# Altium schematic sheet SAFMR_main.SchDoc
size 594 x 420 mm; SheetNumber: 1; SheetTotal: 1
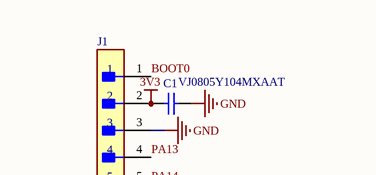
[diagram p0: SAFMR_main.SchDoc, top left]
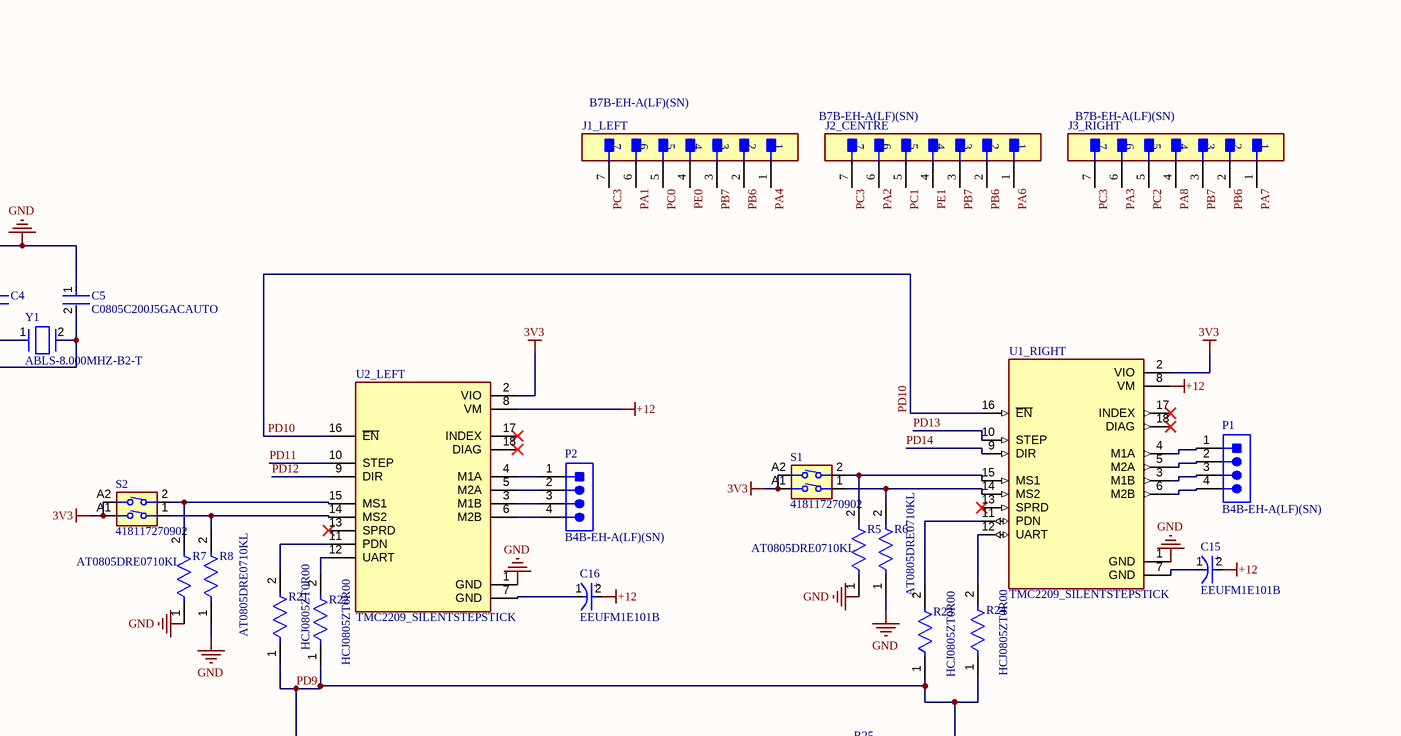
[diagram p1: SAFMR_main.SchDoc, top right]
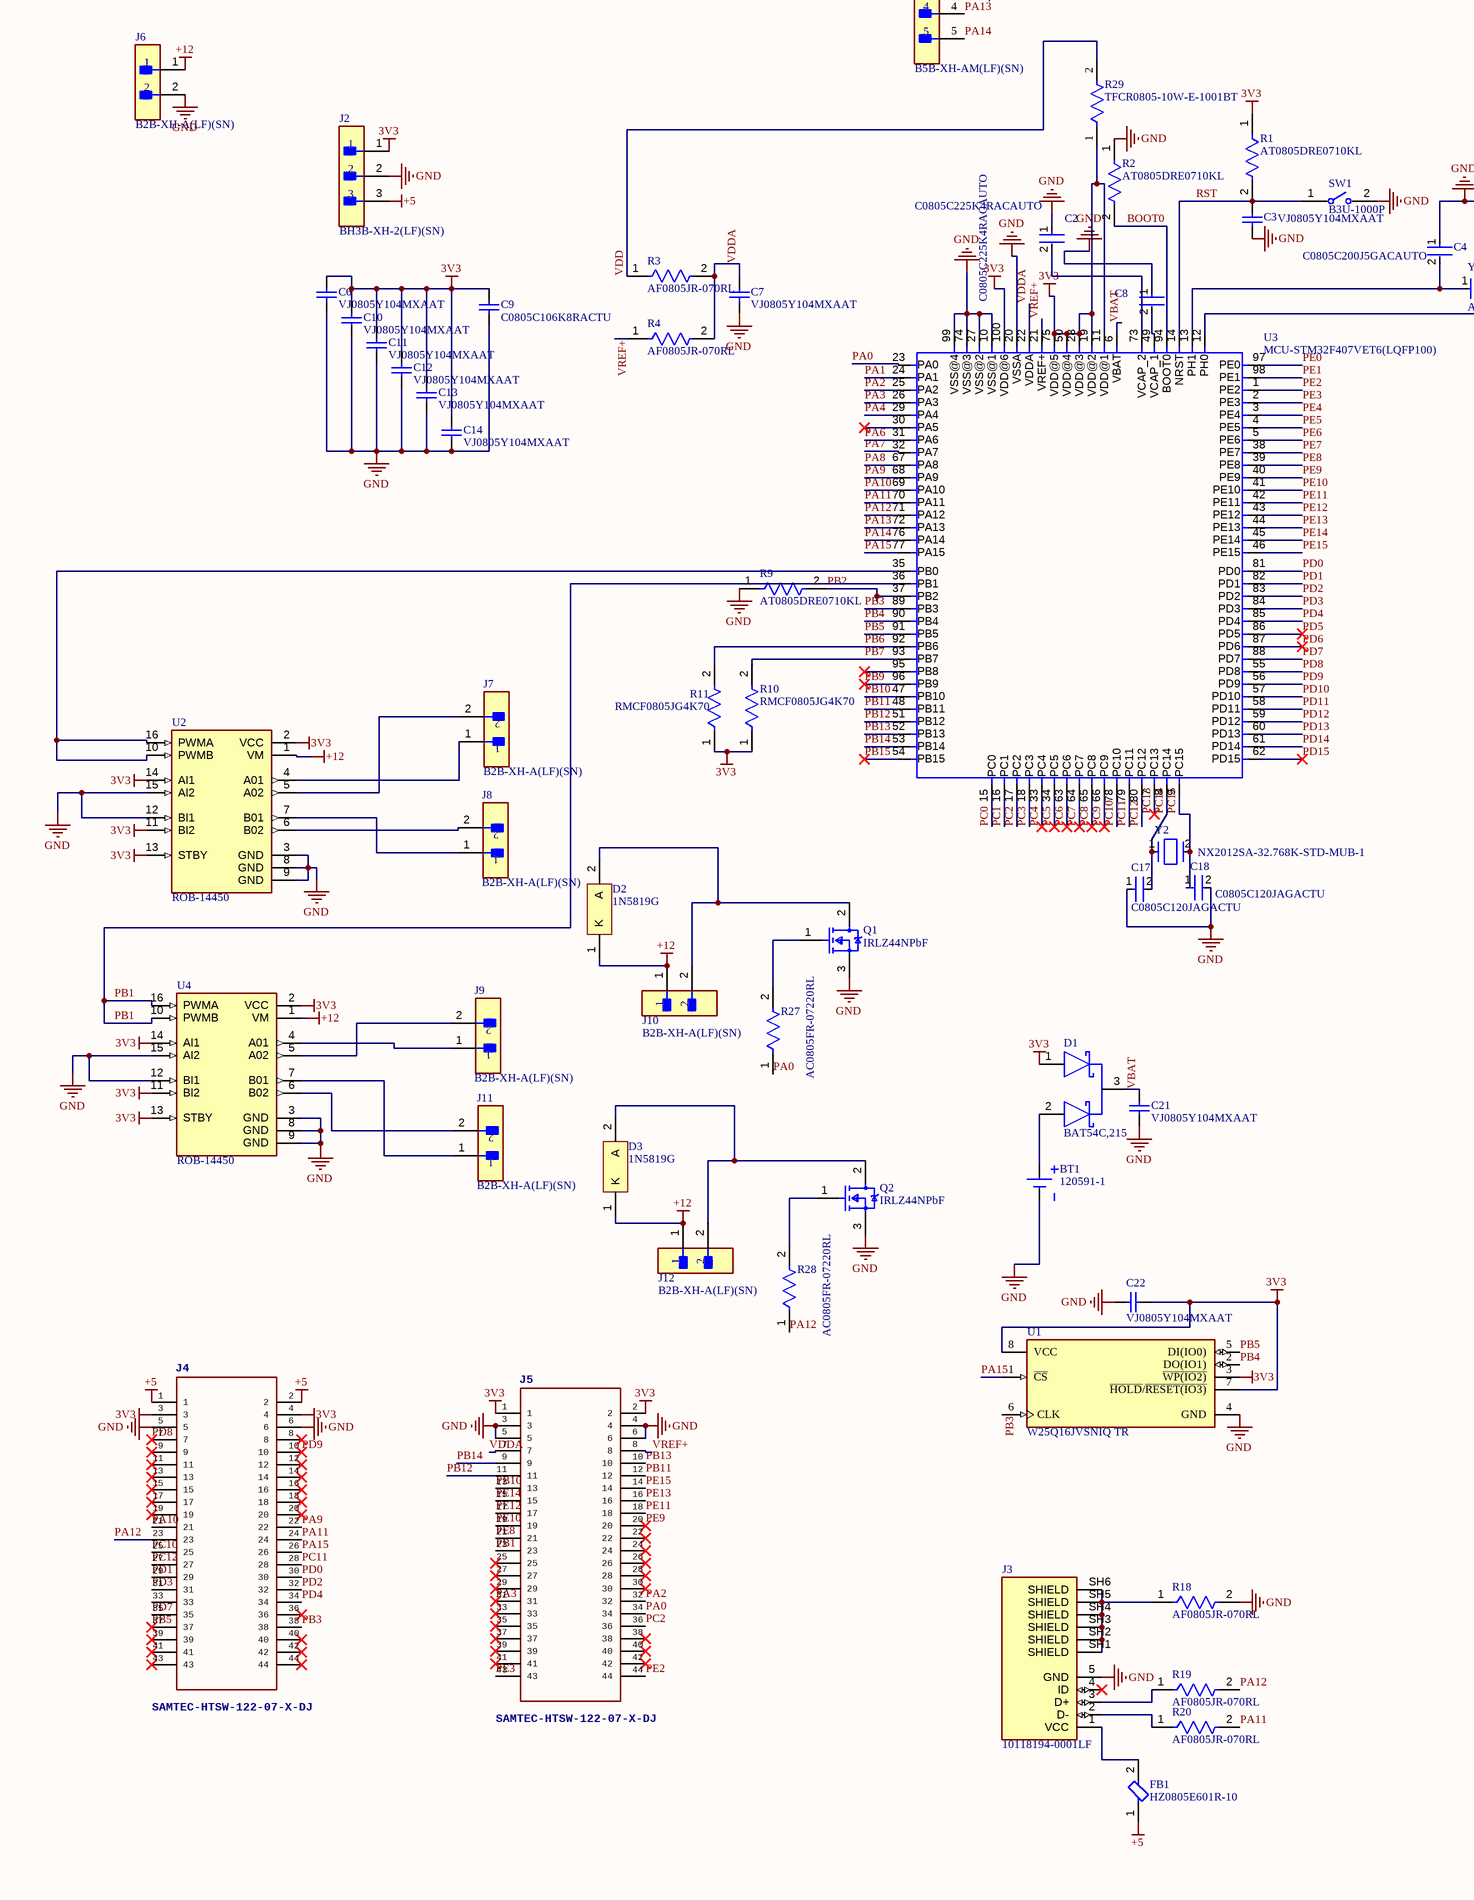
[diagram p2: SAFMR_main.SchDoc, bottom left]
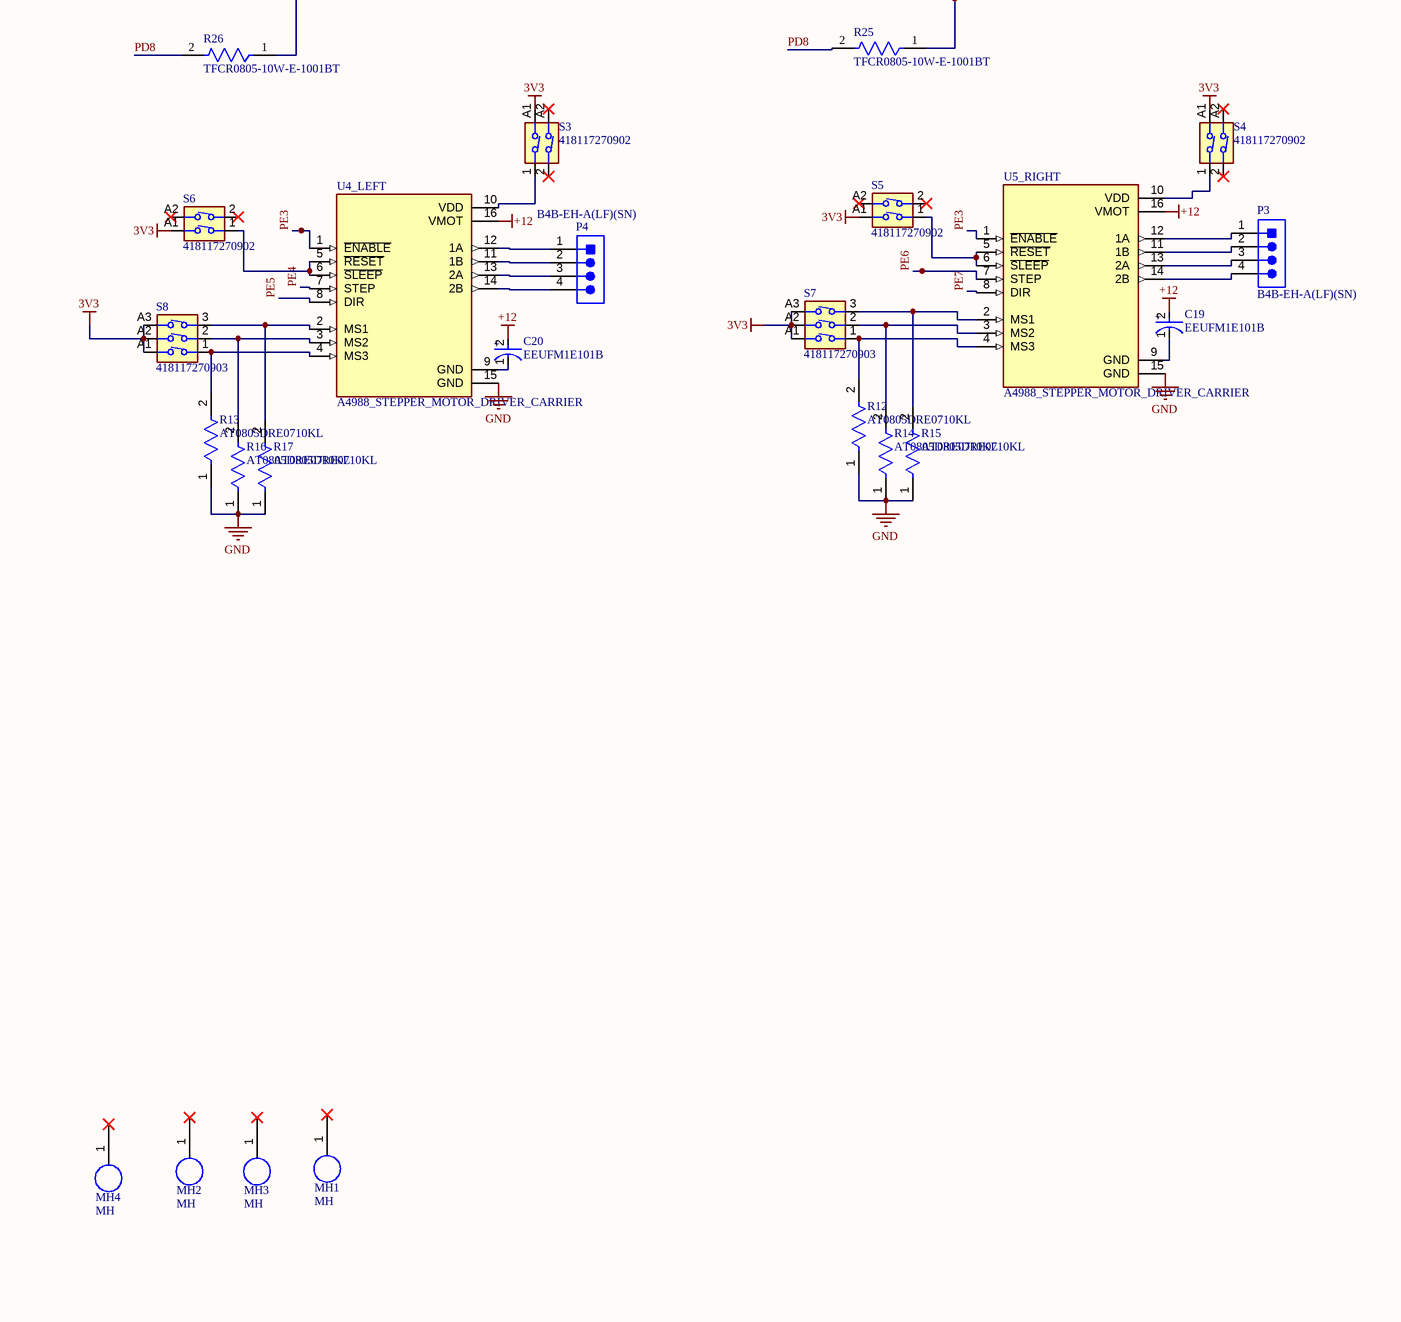
[diagram p3: SAFMR_main.SchDoc, bottom right]

## Parts
BT1  120591-1  [TECO-120591-1-2_V]
C1  VJ0805Y104MXAAT  [CAPC2013X145X48NL20T23]
C2  C0805C225K4RACAUTO  [FP-C0805C225K4RACAUTO-MFG]
C3  VJ0805Y104MXAAT  [CAPC2013X145X48NL20T23]
C4  C0805C200J5GACAUTO  [FP-C0805C-DN-MFG]
C5  C0805C200J5GACAUTO  [FP-C0805C-DN-MFG]
C6  VJ0805Y104MXAAT  [CAPC2013X145X48NL20T23]
C7  VJ0805Y104MXAAT  [CAPC2013X145X48NL20T23]
C8  C0805C225K4RACAUTO  [FP-C0805C225K4RACAUTO-MFG]
C9  C0805C106K8RACTU  [CAPC2013X145X50LL20T25]
C10  VJ0805Y104MXAAT  [CAPC2013X145X48NL20T23]
C11  VJ0805Y104MXAAT  [CAPC2013X145X48NL20T23]
C12  VJ0805Y104MXAAT  [CAPC2013X145X48NL20T23]
C13  VJ0805Y104MXAAT  [CAPC2013X145X48NL20T23]
C14  VJ0805Y104MXAAT  [CAPC2013X145X48NL20T23]
C15  EEUFM1E101B  [FP-RAD-TH-D_6_3_0_5-L_11-MFG]
C16  EEUFM1E101B  [FP-RAD-TH-D_6_3_0_5-L_11-MFG]
C17  C0805C120JAGACTU  [FP-C0805C-DN-MFG]
C18  C0805C120JAGACTU  [FP-C0805C-DN-MFG]
C19  EEUFM1E101B  [FP-RAD-TH-D_6_3_0_5-L_11-MFG]
C20  EEUFM1E101B  [FP-RAD-TH-D_6_3_0_5-L_11-MFG]
C21  VJ0805Y104MXAAT  [CAPC2013X145X48NL20T23]
C22  VJ0805Y104MXAAT  [CAPC2013X145X48NL20T23]
D1  BAT54C,215  [FP-SOT23-MFG]
D2  1N5819G  [ONSC-AXIAL_LEAD-2-59-10_P]
D3  1N5819G  [ONSC-AXIAL_LEAD-2-59-10_P]
FB1  HZ0805E601R-10  [FP-HZ0805-MFG]
J1  B5B-XH-AM(LF)(SN)  [FP-B5B-XH-AM_LF_SN-MFG]
J1_LEFT  B7B-EH-A(LF)(SN)  [FP-B7B-EH-A_LF_SN-MFG]
J2  BH3B-XH-2(LF)(SN)  [FP-BH3B-XH-2_LF_SN-MFG]
J2_CENTRE  B7B-EH-A(LF)(SN)  [FP-B7B-EH-A_LF_SN-MFG]
J3  10118194-0001LF  [AMPHENOL_10118194-0001LF]
J3_RIGHT  B7B-EH-A(LF)(SN)  [FP-B7B-EH-A_LF_SN-MFG]
J4  SAMTEC-HTSW-122-07-X-DJ  [SAMTEC-HTSW-122-07-X-D]
J5  SAMTEC-HTSW-122-07-X-DJ  [SAMTEC-HTSW-122-07-X-D]
J6  B2B-XH-A(LF)(SN)  [FP-B2B-XH-A_LF_SN-MFG]
J7  B2B-XH-A(LF)(SN)  [FP-B2B-XH-A_LF_SN-MFG]
J8  B2B-XH-A(LF)(SN)  [FP-B2B-XH-A_LF_SN-MFG]
J9  B2B-XH-A(LF)(SN)  [FP-B2B-XH-A_LF_SN-MFG]
J10  B2B-XH-A(LF)(SN)  [FP-B2B-XH-A_LF_SN-MFG]
J11  B2B-XH-A(LF)(SN)  [FP-B2B-XH-A_LF_SN-MFG]
J12  B2B-XH-A(LF)(SN)  [FP-B2B-XH-A_LF_SN-MFG]
MH1  MH  [MH]
MH2  MH  [MH]
MH3  MH  [MH]
MH4  MH  [MH]
P1  B4B-EH-A(LF)(SN)  [JST-B4B-EH-A_V]
P2  B4B-EH-A(LF)(SN)  [JST-B4B-EH-A_V]
P3  B4B-EH-A(LF)(SN)  [JST-B4B-EH-A_V]
P4  B4B-EH-A(LF)(SN)  [JST-B4B-EH-A_V]
Q1  IRLZ44NPbF  [FP-PG-TO220-3-MFG]
Q2  IRLZ44NPbF  [FP-PG-TO220-3-MFG]
R1  AT0805DRE0710KL  [FP-AT0805-MFG]
R2  AT0805DRE0710KL  [FP-AT0805-MFG]
R3  AF0805JR-070RL  [FP-AF0805-IPC_B]
R4  AF0805JR-070RL  [FP-AF0805-IPC_B]
R5  AT0805DRE0710KL  [FP-AT0805-MFG]
R6  AT0805DRE0710KL  [FP-AT0805-MFG]
R7  AT0805DRE0710KL  [FP-AT0805-MFG]
R8  AT0805DRE0710KL  [FP-AT0805-MFG]
R9  AT0805DRE0710KL  [FP-AT0805-MFG]
R10  RMCF0805JG4K70  [FP-RMCF0805-MFG]
R11  RMCF0805JG4K70  [FP-RMCF0805-MFG]
R12  AT0805DRE0710KL  [FP-AT0805-MFG]
R13  AT0805DRE0710KL  [FP-AT0805-MFG]
R14  AT0805DRE0710KL  [FP-AT0805-MFG]
R15  AT0805DRE0710KL  [FP-AT0805-MFG]
R16  AT0805DRE0710KL  [FP-AT0805-MFG]
R17  AT0805DRE0710KL  [FP-AT0805-MFG]
R18  AF0805JR-070RL  [FP-AF0805-IPC_B]
R19  AF0805JR-070RL  [FP-AF0805-IPC_B]
R20  AF0805JR-070RL  [FP-AF0805-IPC_B]
R21  HCJ0805ZT0R00  [FP-HCJ0805-MFG]
R22  HCJ0805ZT0R00  [FP-HCJ0805-MFG]
R23  HCJ0805ZT0R00  [FP-HCJ0805-MFG]
R24  HCJ0805ZT0R00  [FP-HCJ0805-MFG]
R25  TFCR0805-10W-E-1001BT  [FP-TFCR0805-IPC_A]
R26  TFCR0805-10W-E-1001BT  [FP-TFCR0805-IPC_A]
R27  AC0805FR-07220RL  [FP-AC0805-MFG]
R28  AC0805FR-07220RL  [FP-AC0805-MFG]
R29  TFCR0805-10W-E-1001BT  [FP-TFCR0805-IPC_A]
S1  418117270902  [418117270902]
S2  418117270902  [418117270902]
S3  418117270902  [418117270902]
S4  418117270902  [418117270902]
S5  418117270902  [418117270902]
S6  418117270902  [418117270902]
S7  418117270903  [418117270903]
S8  418117270903  [418117270903]
SW1  B3U-1000P  [FP-B3U-1000P-MFG]
U1  W25Q16JVSNIQ TR  [FP-W25Q16JVSNIQ_TR-IPC_A]
U1_RIGHT  TMC2209_SILENTSTEPSTICK  [MODULE_TMC2209_SILENTSTEPSTICK]
U2  ROB-14450  [MODULE_ROB-14450]
U2_LEFT  TMC2209_SILENTSTEPSTICK  [MODULE_TMC2209_SILENTSTEPSTICK]
U3  MCU-STM32F407VET6(LQFP100)  [LQFP100-0.5-13.8X13.8MM]
U4  ROB-14450  [MODULE_ROB-14450]
U4_LEFT  A4988_STEPPER_MOTOR_DRIVER_CARRIER  [MODULE_A4988_STEPPER_MOTOR_DRIVER_CARRIER]
U5_RIGHT  A4988_STEPPER_MOTOR_DRIVER_CARRIER  [MODULE_A4988_STEPPER_MOTOR_DRIVER_CARRIER]
Y1  ABLS-8.000MHZ-B2-T  [FP-ABLS-MFG]
Y2  NX2012SA-32.768K-STD-MUB-1  [FP-NX2012SA-MFG]

## Nets
3V3: C1.2 C6.2 C9.2 C10.2 C11.2 C12.2 C13.2 C14.2 C22.1 D1.1(1_ANODE) J1.2 J2.1 J4.3 J4.4 J5.1 J5.2 R1.1 R10.1 R11.1 R29.1 S1.A1 S1.A2 S2.A1 S2.A2 S3.A1 S4.A1 S5.A1 S6.A1 S7.A1 S7.A2 S7.A3 S8.A1 S8.A2 S8.A3 U1.3(~{WP(IO2)}) U1.7(~{HOLD}/~{RESET(IO3)}) U1.8(VCC) U1_RIGHT.2(VIO) U2.2(VCC) U2.11(BI2) U2.13(STBY) U2.14(AI1) U2_LEFT.2(VIO) U3.11(VDD@1) U3.19(VDD@2) U3.28(VDD@3) U3.50(VDD@4) U3.75(VDD@5) U3.100(VDD@6) U4.2(VCC) U4.11(BI2) U4.13(STBY) U4.14(AI1)
+5: FB1.1 J2.3 J4.1 J4.2
+12: C15.2(A) C16.2(A) C19.2(A) C20.2(A) D2.1(K) D3.1(K) J6.1 J10.1 J12.1 U1_RIGHT.8(VM) U2.1(VM) U2_LEFT.8(VM) U4.1(VM) U4_LEFT.16(VMOT) U5_RIGHT.16(VMOT)
GND: BT1.2(-) C1.1 C2.1 C3.1 C4.1 C5.1 C6.1 C7.1 C8.1 C9.1 C10.1 C11.1 C12.1 C13.1 C14.1 C17.1 C18.2 C21.1 C22.2 J1.3 J2.2 J3.5(GND) J4.5 J4.6 J5.3 J5.4 J5.5 J5.6 J6.2 Q1.3(S) Q2.3(S) R2.1 R5.1 R6.1 R7.1 R8.1 R9.1 R12.1 R13.1 R14.1 R15.1 R16.1 R17.1 R18.2 SW1.2 U1.4(GND) U1_RIGHT.1(GND) U2.3(GND) U2.8(GND) U2.9(GND) U2.12(BI1) U2.15(AI2) U2_LEFT.1(GND) U3.10(VSS@1) U3.20(VSSA) U3.27(VSS@2) U3.74(VSS@3) U3.99(VSS@4) U4.3(GND) U4.8(GND) U4.9(GND) U4.12(BI1) U4.15(AI2) U4_LEFT.15(GND) U5_RIGHT.15(GND)
BOOT0: J1.1 R2.2 U3.94(BOOT0)
PA0: J5.34 R27.1 U3.23(PA0)
PA1: J1_LEFT.6 U3.24(PA1)
PA2: J2_CENTRE.6 J5.32 U3.25(PA2)
PA3: J3_RIGHT.6 J5.31 U3.26(PA3)
PA4: J1_LEFT.1 U3.29(PA4)
PA6: J2_CENTRE.1 U3.31(PA6)
PA7: J3_RIGHT.1 U3.32(PA7)
PA8: J3_RIGHT.4 U3.67(PA8)
PA9: J4.22 U3.68(PA9)
PA10: J4.21 U3.69(PA10)
PA11: J4.24 R20.2 U3.70(PA11)
PA12: J4.23 R19.2 R28.1 U3.71(PA12)
PA13: J1.4 U3.72(PA13)
PA14: J1.5 U3.76(PA14)
PA15: J4.26 U1.1(~{CS}) U3.77(PA15)
PB1: J5.23 U3.36(PB1) U4.10(PWMB) U4.16(PWMA)
PB2: R9.2 U3.37(PB2)
PB3: J4.38 U1.6(CLK) U3.89(PB3)
PB4: U1.2(DO(IO1)) U3.90(PB4)
PB5: J4.37 U1.5(DI(IO0)) U3.91(PB5)
PB6: J1_LEFT.2 J2_CENTRE.2 J3_RIGHT.2 R11.2 U3.92(PB6)
PB7: J1_LEFT.3 J2_CENTRE.3 J3_RIGHT.3 R10.2 U3.93(PB7)
PB9: U3.96(PB9)
PB10: J5.13 U3.47(PB10)
PB11: J5.12 U3.48(PB11)
PB12: J5.11 U3.51(PB12)
PB13: J5.10 U3.52(PB13)
PB14: J5.9 U3.53(PB14)
PB15: U3.54(PB15)
PC0: J1_LEFT.5 U3.15(PC0)
PC1: J2_CENTRE.5 U3.16(PC1)
PC2: J3_RIGHT.5 J5.36 U3.17(PC2)
PC3: J1_LEFT.7 J2_CENTRE.7 J3_RIGHT.7 U3.18(PC3)
PC4: U3.33(PC4)
PC5: U3.34(PC5)
PC6: U3.63(PC6)
PC7: U3.64(PC7)
PC8: U3.65(PC8)
PC9: U3.66(PC9)
PC10: J4.25 U3.78(PC10)
PC11: J4.28 U3.79(PC11)
PC12: J4.27 U3.80(PC12)
PC13: U3.7(PC13)
PC14: C17.2 U3.8(PC14) Y2.1
PC15: C18.1 U3.9(PC15) Y2.2
PD0: J4.30 U3.81(PD0)
PD1: J4.29 U3.82(PD1)
PD2: J4.32 U3.83(PD2)
PD3: J4.31 U3.84(PD3)
PD4: J4.34 U3.85(PD4)
PD5: U3.86(PD5)
PD6: U3.87(PD6)
PD7: J4.35 U3.88(PD7)
PD8: J4.7 R25.2 R26.2 U3.55(PD8)
PD9: J4.10 R21.1 R22.1 R23.1 R24.1 R25.1 R26.1 U3.56(PD9)
PD10: U1_RIGHT.16(~{EN}) U2_LEFT.16(~{EN}) U3.57(PD10)
PD11: U2_LEFT.10(STEP) U3.58(PD11)
PD12: U2_LEFT.9(DIR) U3.59(PD12)
PD13: U1_RIGHT.10(STEP) U3.60(PD13)
PD14: U1_RIGHT.9(DIR) U3.61(PD14)
PD15: U3.62(PD15)
PE0: J1_LEFT.4 U3.97(PE0)
PE1: J2_CENTRE.4 U3.98(PE1)
PE2: J5.44 U3.1(PE2)
PE3: J5.43 U3.2(PE3) U4_LEFT.1(~{ENABLE}) U5_RIGHT.1(~{ENABLE})
PE4: U3.3(PE4) U4_LEFT.7(STEP)
PE5: U3.4(PE5) U4_LEFT.8(DIR)
PE6: U3.5(PE6) U5_RIGHT.7(STEP)
PE7: U3.38(PE7) U5_RIGHT.8(DIR)
PE8: J5.21 U3.39(PE8)
PE9: J5.20 U3.40(PE9)
PE10: J5.19 U3.41(PE10)
PE11: J5.18 U3.42(PE11)
PE12: J5.17 U3.43(PE12)
PE13: J5.16 U3.44(PE13)
PE14: J5.15 U3.45(PE14)
PE15: J5.14 U3.46(PE15)
RST: C3.2 R1.2 SW1.1 U3.14(NRST)
VBAT: C21.2 D1.3(COMMON_CATHODE) U3.6(VBAT)
VDD: R3.1 R29.2
VDDA: C7.2 J5.7 R3.2 R4.2 U3.22(VDDA)
VREF+: J5.8 R4.1 U3.21(VREF+)
NetBT1_1: BT1.1(+) D1.2(2_ANODE)
NetC2_2: C2.2 U3.73(VCAP_2)
NetC4_2: C4.2 U3.13(PH1) Y1.1
NetC5_2: C5.2 U3.12(PH0) Y1.2
NetC8_2: C8.2 U3.49(VCAP_1)
NetC15_1: C15.1(C) U1_RIGHT.7(GND)
NetC16_1: C16.1(C) U2_LEFT.7(GND)
NetC19_1: C19.1(C) U5_RIGHT.9(GND)
NetC20_1: C20.1(C) U4_LEFT.9(GND)
NetD2_2: D2.2(A) J10.2 Q1.2(D)
NetD3_2: D3.2(A) J12.2 Q2.2(D)
NetFB1_2: FB1.2 J3.1(VCC)
NetJ3_2: J3.2(D-) R20.1
NetJ3_3: J3.3(D+) R19.1
NetJ3_SH1: J3.SH1(SHIELD) J3.SH2(SHIELD) J3.SH3(SHIELD) J3.SH4(SHIELD) J3.SH5(SHIELD) J3.SH6(SHIELD) R18.1
NetJ7_1: J7.1 U2.4(A01)
NetJ7_2: J7.2 U2.5(A02)
NetJ8_1: J8.1 U2.7(B01)
NetJ8_2: J8.2 U2.6(B02)
NetJ9_1: J9.1 U4.4(A01)
NetJ9_2: J9.2 U4.5(A02)
NetJ11_1: J11.1 U4.7(B01)
NetJ11_2: J11.2 U4.6(B02)
NetP1_1: P1.1 U1_RIGHT.4(M1A)
NetP1_2: P1.2 U1_RIGHT.5(M2A)
NetP1_3: P1.3 U1_RIGHT.3(M1B)
NetP1_4: P1.4 U1_RIGHT.6(M2B)
NetP2_1: P2.1 U2_LEFT.4(M1A)
NetP2_2: P2.2 U2_LEFT.5(M2A)
NetP2_3: P2.3 U2_LEFT.3(M1B)
NetP2_4: P2.4 U2_LEFT.6(M2B)
NetP3_1: P3.1 U5_RIGHT.12(1A)
NetP3_2: P3.2 U5_RIGHT.11(1B)
NetP3_3: P3.3 U5_RIGHT.13(2A)
NetP3_4: P3.4 U5_RIGHT.14(2B)
NetP4_1: P4.1 U4_LEFT.12(1A)
NetP4_2: P4.2 U4_LEFT.11(1B)
NetP4_3: P4.3 U4_LEFT.13(2A)
NetP4_4: P4.4 U4_LEFT.14(2B)
NetQ1_1: Q1.1(G) R27.2
NetQ2_1: Q2.1(G) R28.2
NetR5_2: R5.2 S1.2 U1_RIGHT.15(MS1)
NetR6_2: R6.2 S1.1 U1_RIGHT.14(MS2)
NetR7_2: R7.2 S2.2 U2_LEFT.15(MS1)
NetR8_2: R8.2 S2.1 U2_LEFT.14(MS2)
NetR12_2: R12.2 S7.1 U5_RIGHT.4(MS3)
NetR13_2: R13.2 S8.1 U4_LEFT.4(MS3)
NetR14_2: R14.2 S7.2 U5_RIGHT.3(MS2)
NetR15_2: R15.2 S7.3 U5_RIGHT.2(MS1)
NetR16_2: R16.2 S8.2 U4_LEFT.3(MS2)
NetR17_2: R17.2 S8.3 U4_LEFT.2(MS1)
NetR21_2: R21.2 U2_LEFT.11(PDN)
NetR22_2: R22.2 U2_LEFT.12(UART)
NetR23_2: R23.2 U1_RIGHT.11(PDN)
NetR24_2: R24.2 U1_RIGHT.12(UART)
NetS3_1: S3.1 U4_LEFT.10(VDD)
NetS4_1: S4.1 U5_RIGHT.10(VDD)
NetS5_1: S5.1 U5_RIGHT.5(~{RESET}) U5_RIGHT.6(~{SLEEP})
NetS6_1: S6.1 U4_LEFT.5(~{RESET}) U4_LEFT.6(~{SLEEP})
NetU2_10: U2.10(PWMB) U2.16(PWMA) U3.35(PB0)

Not connected (* = marked no-connect by the designer): J3 4(ID)*; J4 8* 9* 11* 12* 13* 14* 15* 16* 17* 18* 19* 20* 33 36* 39* 40* 41* 42* 43* 44*; J5 22* 24* 25* 26* 27* 28* 29* 30* 33* 35* 37* 38* 39* 40* 41* 42*; MH1 1*; MH2 1*; MH3 1*; MH4 1*; S3 2* A2*; S4 2* A2*; S5 2* A2*; S6 2* A2*; U1_RIGHT 13(SPRD)* 17(INDEX)* 18(DIAG)*; U2_LEFT 13(SPRD)* 17(INDEX)* 18(DIAG)*; U3 30(PA5)* 95(PB8)*

## Notes on the sheet
- DWG NO:
- REV:
- THIS DOCUMENT AND THE DATA DISCLOSED HEREIN OR
- HEREWITH IS THE PROPERTY OF ALTIUM LIMITED AND MAY
- BE FREELY DISTRIBUTED IN WHOLE. NO RIGHTS ARE
- RESERVED OR EXPRESS OR IMPLIED WARANTEE GIVEN.
- REVISION
- DESCRIPTION
- DATE
- APPROVED
- ENG:
- APPROVALS
- PROJECT
- DSN:
- CHK:
- REFERENCE DOCUMENTS
- PROJECT REVISION:
- TITLE
- DOCUMENT REVISION:
- DESIGN ITEM:
- BOM:
- FAB DWG:
- PCB DWG:
- ASSY DWG:
- SCALE:
- A2
- SIZE
- CAGE CODE
- FILE NAME
- DWG NO.
- SHEET
- OF
- REV
- (in symbol CMP-05427-000856-1) +

## Library data of the parts
BT1 = CMP-0438-00001-2: Lithium Battery Holder for CR2032 3V Cell; Manufacturer: TE Connectivity; Packing Type: Tray; Body Shape: Horizontal Cylindrical; AccessRights: 2147483647; RevisionId: 1; Folder: Unified Components\Components\TE Connectivity\Connectors & Connector Components\Power Products\Battery Interconnection Products\; ContentType: Unified Component; ContentTypeGUID: CB3C11C4-E317-11DF-B822-12313F0024A2; ComponentLink1Description: Manufacturer URL; LifeCycleStateGUID: 61E382EE-6656-4F12-9E24-BE9327104A25; FolderGUID: A6761B51-D489-48A3-9180-F4808F45AB79; PartNumber: 120591-1; LifeCycle: Released; ReleaseDate: 20/08/2013 02:50:22 AM; PackageReference: 120591-1; ComponentLink2URL: http://www.te.com/commerce/DocumentDelivery/DDEController?Action=showdoc&DocId=Customer+Drawing%7F120591%7FH%7Fpdf%7FEnglish%7FENG_CD_120591_H.pdf%7F120591-1; DatasheetVersion: Rev. H, 01/2013; PackageDescription: Lithium Battery Holder; ItemGUID: B2C50140-681E-4F62-8DBB-9728605318CE; ItemHRID: CMP-0438-00001; Mounting Technology: Through Hole; ComponentLink1URL: http://www.te.com/; ComponentLink2Description: Datasheet
C1 C3 C6 C7 C10-C14 C21 C22 = CMP-2007-01733-1: Manufacturer: Vitramon; Part Number: VJ0805Y104MXAAT
C2 C8 = CMP-2007-03267-2: CAP CER 2.2UF 16V X7R 0805; Tolerance: 10%; Dielectric Material: Ceramic; Packaging: Cut Tape; Depth: 1.25mm; Package Quantity: 1; Case Code (Imperial): 0805; Contact Plating: Tin; REACH SVHC: No SVHC; Case/Package: 0805; Max Operating Temperature: 125°C; Thickness: 0.055inch; Height: 1.25mm; Mount: Surface Mount; Min Operating Temperature: -55°C; Construction: Flat; Series: C; Radiation Hardening: No; Capacitance: 2.2uF; Dielectric: X7R; Case Code (Metric): 2012; Length: 0.079inch; RoHS Compliant: Yes; Width: 0.049inch; Voltage Rating: 16V; Voltage Rating (DC): 16V; Ratings: AEC-Q200
C4 C5 = CMP-03020-000773-1: C0805 20 pF C0G 30ppm/°C 5.00% 50 V; Manufacturer: KEMET; Value: 20 pF; Tolerance: 0.05; Material: Ceramic; Voltage Rating: 50 V; Temperature Characteristic: C0G; Manufacturer Part Number: C0805C200J5GACAUTO; Lead Free: Yes; RoHS: TRUE; Ipc Land Pattern Name: CAPC200125X78; Package: C0805C-DN; Height: 0.88mm; Device Class L2: Capacitors; Temperature Coefficient: 30ppm/°C; ComponentLink2Description: Datasheet; Temperature Range Low: -55°C; Device Class L1: Passive Components; Device Class L3: Ceramic Capacitors; Temperature: -55°C to +125°C; Category: Cap; Capacitance: 20 pF; Octopart: https://octopart.com/c0805c200j5gacauto-kemet-88373638; ComponentLink2URL: https://content.kemet.com/datasheets/KEM_C1003_C0G_SMD.pdf; Automotive: No; Temperature Range High: +125°C
C9 = CMP-2007-01044-1: Manufacturer: Kemet; Part Number: C0805C106K8RACTU
C15 C16 C19 C20 = CMP-05427-000856-1: Aluminum Electrolytic Capacitors (Radial Lead Type) 100uF ±20% 25V; Lead Diameter: 0.5mm; Polarity: Polar; Ripple Current: 455mA; Impedance: 130mR; Life (Hours): 2000Hour; Length: 11mm; Min Operating Temperature: -40°C; Termination: Radial; Diameter: 6mm; Lead Pitch: 5mm; Tolerance: 20%; Capacitance: 100uF; Case/Package: Radial; Voltage Rating (DC): 25V; Height - Seated (Max): 0.5inch; RoHS Compliant: Yes; Series: FM; Package Quantity: 2000; Voltage Rating: 25V; Max Operating Temperature: 105°C; Mount: Through Hole; ESR (Equivalent Series Resistance): 130mR; Packaging: Tape and Reel
C17 C18 = CMP-03020-011084-1: C0805 12 pF C0G 30ppm/°C 5.00% 250 V; Manufacturer: KEMET; Material: Ceramic; Voltage Rating: 250 V; Value: 12 pF; Tolerance: 0.05; Category: Cap; Ipc Land Pattern Name: CAPC200125X78; Height: 0.88mm; Device Class L3: Ceramic Capacitors; Temperature: -55°C to +125°C; ComponentLink2Description: Datasheet; Temperature Characteristic: C0G; Manufacturer Part Number: C0805C120JAGACTU; Octopart: https://octopart.com/c0805c120jagactu-kemet-88373179; ComponentLink2URL: https://content.kemet.com/datasheets/KEM_C1003_C0G_SMD.pdf; Lead Free: Yes; Capacitance: 12 pF; Automotive: No; Device Class L1: Passive Components; Device Class L2: Capacitors; Temperature Range Low: -55°C; RoHS: TRUE; Temperature Coefficient: 30ppm/°C; Package: C0805C-DN; Temperature Range High: +125°C
D1 = CMP-14398-000007-1: DIODE ARRAY SCHOTTKY 30V SOT23; Manufacturer: Nexperia; Automotive Grade: Grade 0; Peak Reverse Current: 2uA; Forward Current: 200mA; Max Surge Forward Current: 600mA; Value: 10pF; Max Junction Temp: +150°C; Lead Free: Yes; Automotive: Yes; Device Class L1: Discrete Semiconductors; Digikey Description: DIODE ARRAY SCHOTTKY 30V SOT23; Reverse Voltage: 30V; ComponentLink2URL: https://assets.nexperia.com/documents/data-sheet/BAT54_SER.pdf; Device Class L2: Diodes; Category: Diode; Octopart: https://octopart.com/bat54c%2C215-nexperia-78738945; Package: SOT23; Mouser Description: Schottky Diodes, Rectifiers - Arrays SOT-23 (TO-236AB) 30V 200mA (DC) Surface Mount; RoHS: TRUE; Manufacturer Part Number: BAT54C,215; Temperature: to +150°C; Ambient Temperature Range Low: -55°C; Height: 1.1mm; Device Class L3: Schottky Diodes; Temperature Range High: +150°C; Footprint Url: https://assets.nexperia.com/documents/outline-drawing/SOT23.pdf; Capacitance: 10pF; Ambient Temperature Range High: +150°C; Ipc Land Pattern Name: SOT95P230X100-3; ComponentLink2Description: Datasheet
D2 D3 = CMP-1055-00041-1: Rectifier, 2-Pin Axial_Lead, Pb-Free, Bulk Bag; Manufacturer: On Semiconductor; IFSM Max (A): 25; Configuration: Single; PackageDescription: 2-Pin, Axial Lead, Diameter 2.35 mm; ComponentLink2URL: http://www.onsemi.cn/pub_link/Collateral/1N5817-D.PDF; ComponentLink1Description: Manufacturer URL; Mounting Technology: Through Hole; RoHS: TRUE; ComponentLink2Description: Datasheet; ComponentLink1URL: http://www.onsemi.com/; PartNumber: 1N5819G; DatasheetVersion: Rev. 10; Packing: Bulk Bag; PackageVersion: Rev. U, 02/2005; PackageReference: AXIAL_LEAD-2-59-10; ComponentLink3URL: http://www.onsemi.cn/pub_link/Collateral/59-10.PDF; ComponentLink3Description: Package Specification
FB1 = CMP-2000-05194-2: FERRITE BEAD 600 OHM 0805 1LN; Current Rating: 500mA; Frequency: 100MHz; DC Resistance (DCR): 300mR; Number of Lines: 1; Impedance: 600R; Packaging: Tape and Reel; Mount: Surface Mount; Package Quantity: 1; Material: Ferrite; Width: 0.049inch; Min Operating Temperature: -40°C; Core Material: Ferrite; Max Current Rating: 500mA; Case Code (Metric): 2012; Depth: 1.45mm; Case Code (Imperial): 0805; Termination: SMD/SMT; Contact Plating: Tin; Lead Free: Lead Free; Weight: 0.00392oz; Case/Package: 0805; Test Frequency: 100MHz; Length: 2mm; Height: 1.25mm; Max Operating Temperature: 125°C; Max DC Current: 500mA
J1 = CMP-17439-000304-1: CONN HEADER VERT 5POS 2.5MM; Mated Stacking Heights: 9.8mm; Voltage Rating: 250V; Max Current Rating: 3A; Number of Positions: 5; Contact Resistance: 20mR; Depth: 5.75mm; Connector Type: Header; Color: Green; Insulation Material: Nylon; Contact Plating: Copper; Length: 14.9mm; Fastening Type: Detent; Contact Material: Brass; Number of Rows: 1; Contact Type: Male Pin; Housing Material: Polyamide; Housing Color: White; Lead Free: Lead Free; Max Voltage Rating (AC): 250V; Mount: Through Hole; Contact Shape: Square; Min Operating Temperature: -25°C; Packaging: Bulk; Orientation: Straight; Insulation Color: Natural; Series: XH; Flammability Rating: UL94 V-0; Contact Finish - Mating: TIN; Max Operating Temperature: 85°C; Termination: Solder; Pitch: 2.5mm
J1_LEFT J2_CENTRE J3_RIGHT = CMP-17439-000532-1: CONN HEADER VERT 7POS 2.5MM; Number of Contacts: 7; Mated Stacking Heights: 8.1mm; Gender: Male; Current Rating: 3A; Voltage Rating: 250V; Termination: Solder; Contact Material: Brass; Connector Type: Header; Flammability Rating: UL94 V-0; Housing Material: Nylon; Series: EH; Fastening Type: Friction; Lead Free: Lead Free; Insulation Color: Natural; Contact Type: Male Pin; Number of Rows: 1; Packaging: Bulk; Color: Natural; Contact Finish - Mating: TIN; Orientation: Straight; Contact Shape: Square; Contact Plating: Tin; Insulation Material: Nylon; Housing Color: White; Mount: Through Hole; Contact Mating Length: 0.13inch; Pitch: 2.5mm; Number of Positions: 7
J2 = CMP-17439-000649-1: CONN HEADER VERT 3POS 2.5MM; Voltage Rating: 250V; Number of Positions: 3; Mated Stacking Heights: 9.8mm; Pitch: 2.5mm; Contact Finish - Mating: TIN; Series: XH; Width: 5.75mm; Insulation Material: Nylon; Packaging: Bulk; Min Operating Temperature: -25°C; Connector Type: Header; Insulation Color: Natural; Height: 14.2mm; Contact Material: Brass; Length: 9.9mm; Termination: Press-Fit; Fastening Type: Detent; Number of Poles: 3; Flammability Rating: UL94 V-0; Contact Type: Male Pin; Lead Free: Lead Free; Mount: Through Hole; Number of Rows: 1; Max Operating Temperature: 85°C; Contact Shape: Square
J3 = 10118194-0001LF: Micro USB, Input Output Connectors, B TYPE RECEPTACLE with flange; MF: Amphenol ICC; SnapEDA_Link: https://www.snapeda.com/parts/10118194-0001LF/Amphenol+FCI/view-part/?ref=snap; Package: None; Value: *; MP: 10118194-0001LF; Check_prices: https://www.snapeda.com/parts/10118194-0001LF/Amphenol+FCI/view-part/?ref=eda
J6-J12 = CMP-2000-05888-3: CONN HEADER VERT 2POS 2.5MM; Current Rating: 3A; Voltage Rating: 250V; Number of Contacts: 2; Contact Resistance: 20mR; Wire/Cable Gauge: 22AWG; Insulation Resistance: 1GR; Connector Type: Male Pin; Packaging: Bulk; Contact Material: Brass; Lead Free: Lead Free; Orientation: Straight; Contact Plating: Tin; Max Current Rating: 3A; Termination: Solder; Fastening Type: Detent; Depth: 5.75mm; Housing Material: Polyamide; REACH SVHC: No SVHC; Series: XH; Voltage Rating (AC): 250V; Number of Positions: 2; Color: Natural; Contact Type: Male Pin; Max Voltage Rating (DC): 250V; Pitch: 2.5mm; Lead Pitch: 2.5mm; Mount: Through Hole; Max Operating Temperature: 85°C; Length: 7.4mm; Max Voltage Rating (AC): 250V; Min Operating Temperature: -25°C; Number of Rows: 1; Housing Color: White
P1-P4 = CMP-2000-05904-1: Male Header, Pitch 2.5 mm, 1 x 4 Position, Height 6 mm, Tail Length 3.2 mm, -25 to 85 degC, RoHS, Bulk; Manufacturer: JST; Style/Orientation: StraightHeader/Plug; Pitch: 2.5mm; No of Positions: 4; Mounting Technology: SurfaceMount; Package Description: Male Header, Pitch 2.5 mm, 1 x 4 Position, Height 6 mm, Tail Length 3.2 mm; Datasheet Version: 12/2012; Type: ShroudedHeader; Package Reference: B4B-EH-A; Manufacturer URL: http://www.jst.com/home2.html; Termination: Crimp; Datasheet URL: http://www.jst-mfg.com/product/pdf/eng/eEH.pdf
Q1 Q2 = CMP-32901-000488-1: MOSFET N-CH 55V 47A TO220AB; Turn-On Delay Time: 11ns; Gate to Source Voltage (Vgs): 16V; Element Configuration: Single; Rds On Max: 22mR; Turn-Off Delay Time: 26ns; Max Power Dissipation: 110W; Threshold Voltage: 2V; Drain to Source Resistance: 35mR; Input Capacitance: 1.7nF; Continuous Drain Current (ID): 47A; Case/Package: TO-220; Lead Free: Lead Free; Halogen Free: Halogen Free; Packaging: Rail/Tube; Length: 0.414inch; Min Operating Temperature: -55°C; REACH SVHC: No SVHC; Number of Pins: 3; Width: 0.185inch; Drain to Source Voltage (Vdss): 55V; Power Dissipation: 110W; RoHS Compliant: Yes; Max Operating Temperature: 175°C; Height: 0.6inch; Max Dual Supply Voltage: 55V; Drain to Source Breakdown Voltage: 55V; Mount: Through Hole
R1 R2 R5-R9 R12-R17 = CMP-03412-049031-1: Thin Film Chip Resistors Automotive Grade 10kΩ 0.5% 50ppm/°C 0805; Max Power Dissipation: 125mW; Resistance: 10kR; Ratings: AEC-Q200; Length: 0.079inch; Temperature Coefficient: 50ppm/°C; Height: 0.024inch; Min Operating Temperature: -55°C; Case/Package: 0805; Tolerance: 0.5%; RoHS Compliant: Yes; Features: Moisture Resistant; Number of Terminations: 2; Max Operating Temperature: 155°C; Series: AT; Packaging: Tape and Reel; Width: 0.049inch; Resistor Type: Thin Film
R3 R4 R18-R20 = CMP-03412-047152-1: Anti-Sulfurated Chip Resistor Automotive Grade 0Ω Jumper 0.125W 0805; Max Power Dissipation: 125mW; Resistance: 0R; Length: 0.079inch; Package Quantity: 5000; Packaging: Tape and Reel; Height: 0.024inch; Series: AF; Number of Terminations: 2; Weight: 0.000194oz; Width: 1.25mm; Max Operating Temperature: 155°C; Case Code (Metric): 2012; Resistor Type: Thick Film; RoHS Compliant: Yes; Case Code (Imperial): 0805; Min Operating Temperature: -55°C; Case/Package: 0805; Termination: SMD/SMT; Features: Moisture Resistant
R10 R11 = CMP-26527-004085-1: 4.7kΩ ±5% 0.125W 0805 Thick Film Chip Resistor AEC-Q200 compliant; Temperature Coefficient: 200ppm/°C; Max Power Dissipation: 125mW; Resistance: 4.7kR; RoHS Compliant: Yes; Package Quantity: 10000; Packaging: Tape and Reel; Contact Plating: Tin; Radiation Hardening: No; Mount: Surface Mount; Height: 0.026inch; Case Code (Metric): 2012; Tolerance: 5%; Case/Package: 0805; Width: 0.049inch; Series: RMCF; Case Code (Imperial): 0805; Number of Terminations: 2; Min Operating Temperature: -55°C; Resistor Type: Thick Film; Max Operating Temperature: 155°C; Length: 0.079inch; Features: Automotive AEC-Q200
R21-R24 = CMP-26527-000104-1: RES 0 OHM JUMPER 1/2W 0805; Resistance: 0mR; Radiation Hardening: No; Case Code (Imperial): 0805; Number of Terminations: 2; Lead Free: Lead Free; Max Operating Temperature: 155°C; Width: 0.049inch; Case Code (Metric): 2012; Height: 0.026inch; Mount: Surface Mount; Min Operating Temperature: -55°C; Packaging: Tape and Reel; Package Quantity: 1; Termination: Wraparound; Length: 0.079inch; RoHS Compliant: Yes; Case/Package: 0805
R25 R26 R29 = CMP-250906-148809-1: RES Thin Film,  1kΩ, 0.1%, 0.1W, 25ppm/°C, 0805
R27 R28 = CMP-2001-04488-2: RES SMD 220 OHM 1% 1/8W 0805; Manufacturer: Yageo; Value: 220Ω; Tolerance: 0.01; Voltage Rating: 150V; Automotive Grade: Grade 0; Automotive: Yes; Composition: Thick Film; Lead Free: Yes; Octopart: https://octopart.com/ac0805fr-07220rl-yageo-26041145; Series: AC; Device Class L1: Passive Components; Temperature: -55°C to +155°C; Device Class L3: Chip SMD Resistors; Package: AC0805; Digikey Description: RES SMD 220 OHM 1% 1/8W 0805; ComponentLink2URL: http://www.yageo.com/documents/recent/PYu-AC_51_RoHS_L_6.pdf; ComponentLink2Description: Datasheet; Resistance: 220Ω; Mouser Description: Thick Film Resistors - SMD 1/8W 220ohm 1% AEC-Q200; Ipc Land Pattern Name: RESC200125X50; Power Rating: 1/8W; Device Class L2: Resistors; Category: Res; Footprint Url: http://www.yageo.com/exep/pages/download/literatures/PYu-R_Mount_10.pdf; Manufacturer Part Number: AC0805FR-07220RL; Temperature Range Low: -55°C; Height: 0.6mm; Temperature Range High: +155°C; RoHS: TRUE
S1-S6 = 418117270902: Dip Switch SPST 2 Position Through Hole Slide (Standard) Actuator 25mA 24VDC; MF: WÃ¼rth Elektronik; SnapEDA_Link: https://www.snapeda.com/parts/418117270902/W%25C3%25BCrth+Elektronik+Midcom/view-part/?ref=snap; Package: None; Value: *; MP: 418117270902; Check_prices: https://www.snapeda.com/parts/418117270902/W%25C3%25BCrth+Elektronik+Midcom/view-part/?ref=eda
S7 S8 = 418117270903: Dip Switch SPST 3 Position Through Hole Slide (Standard) Actuator 25mA 24VDC; MF: WÃ¼rth Elektronik; SnapEDA_Link: https://www.snapeda.com/parts/418117270903/W%25C3%25BCrth+Elektronik+Midcom/view-part/?ref=snap; Package: None; Value: *; MP: 418117270903; Check_prices: https://www.snapeda.com/parts/418117270903/W%25C3%25BCrth+Elektronik+Midcom/view-part/?ref=eda
SW1 = CMP-2100-03586-2: SWITCH TACTILE SPST-NO 0.05A 12V; Contact Resistance: 100mR; Operating Force: 1.5N; Max Current Rating: 50mA; Switch Travel: 0.15mm; Actuator Type: Standard; Mechanical Life: 200000Cycles; Ratings: Dust Proof; Illumination Type: Non-Illuminated; Throw Configuration: SPST; Actuator Length: 0.4mm; Switch Function: Off-Mom; Height: 1.2mm; Width: 3mm; Weight: 0.000776oz; Contact Material: Silver; Max Voltage Rating (DC): 12V; Insulation Resistance: 100MR; Lead Free: Lead Free; Current Rating: 50mA; Termination: SMD/SMT; Length: 4mm; Voltage Rating (DC): 12V; Contact Current Rating: 50mA; Orientation: Straight; Depth: 2.5mm; Max Operating Temperature: 70°C; Packaging: Tape and Reel; Min Operating Temperature: -25°C; Package Quantity: 1; Mount: Surface Mount; Electrical Life: 200000Cycles
U1 = CMP-78876-000009-2: IC FLASH 16MBIT SPI/QUAD 8SOIC; NexarPartId: 75645707; Max Supply Voltage: 3.6V; Memory Size: 2MB; Interface: SPI; Access Time: 5ms; Min Supply Voltage: 2.7V; RoHS: Non-Compliant; Min Operating Temperature: -40°C; Memory Type: FLASH; Height: 1.75mm; Schedule B: 8542320070, 8542320070; Ambient Temperature Range High: 85°C; Max Operating Temperature: 85°C
U1_RIGHT U2_LEFT = TMC2209_SILENTSTEPSTICK: TMC2209 Motor Controller/Driver Power Management Evaluation Board; MF: Trinamic Motion Control GmbH; MP: TMC2209 SILENTSTEPSTICK; SnapEDA_Link: https://www.snapeda.com/parts/TMC2209%20SILENTSTEPSTICK/Trinamic/view-part/?ref=snap; Package: None; Value: *; Check_prices: https://www.snapeda.com/parts/TMC2209%20SILENTSTEPSTICK/Trinamic/view-part/?ref=eda
U2 U4 = ROB-14450: TB6612FNG Motor Controller/Driver Power Management Evaluation Board; MF: SparkFun Electronics; Check_prices: https://www.snapeda.com/parts/ROB-14450/SparkFun%20Electronics/view-part/2656367/?ref=eda; Package: None; MP: ROB-14450; Value: *; Availability: In Stock; SnapEDA_Link: https://www.snapeda.com/parts/ROB-14450/SparkFun%20Electronics/view-part/2656367/?ref=snap; Price: None
U3 = MCU-STM32F407VET6(LQFP100): ARMÂ® CortexÂ®-M4 STM32F4 Microcontroller IC 32-Bit Single-Core 168MHz 512KB (512K x 8) FLASH 100-LQFP (14x14); MF: STMicroelectronics; Check_prices: https://www.snapeda.com/parts/STM32F407VET6/STMicroelectronics/view-part/?ref=eda; Value: *; Availability: In Stock; MP: STM32F407VET6; Price: None; Package: LQFP-100 STMicroelectronics; SnapEDA_Link: https://www.snapeda.com/parts/STM32F407VET6/STMicroelectronics/view-part/?ref=snap; Purchase-URL: https://pricing.snapeda.com/search/part/STM32F407VET6/?ref=eda
U4_LEFT U5_RIGHT = A4988_STEPPER_MOTOR_DRIVER_CARRIER: Stepper motor controler; IC: A4988; 1A; Uin mot: 8Ã·35V; Price: None; Value: *; MP: A4988_STEPPER_MOTOR_DRIVER_CARRIER; Package: None; Availability: Unavailable
Y1 = CMP-27762-009874-1: CRYSTAL 8.0000MHZ 18PF SMD; ESR (Equivalent Series Resistance): 80R; Operating Frequency: 8 MHz; Frequency Stability: 50ppm; Tolerance: 20ppm; Frequency: 8MHz; Min Operating Temperature: -20°C; Lead Free: Lead Free; Width: 4.7mm; Packaging: Tape and Reel; Series: ABLS; Accuracy: 20ppm; Length: 11.4mm; Frequency Tolerance: 20ppm; Termination: SMD/SMT; Number of Pins: 2; Radiation Hardening: No; Depth: 4.7mm; REACH SVHC: No SVHC; Contact Plating: Tin; Load Capacitance: 18pF; Case/Package: SMD/SMT; Mount: Surface Mount; Package Quantity: 1000; Max Operating Temperature: 70°C; Height: 0.165inch; Series Resistance: 80R
Y2 = CMP-200220-000019-1: CRYSTAL 32.7680KHZ 12.5PF SMD; Frequency Tolerance: 20ppm; ESR (Equivalent Series Resistance): 80kR; Frequency: 32.768kHz; Mount: Surface Mount; Packaging: Cut Tape; Min Operating Temperature: -40°C; Max Operating Temperature: 85°C; Case/Package: SMD/SMT; RoHS Compliant: Yes; Length: 0.081inch; Series: NX2012SA; Height: 0.024inch; Width: 0.047inch; Load Capacitance: 12.5pF